# Altium schematic sheet Top.SchDoc
size A4
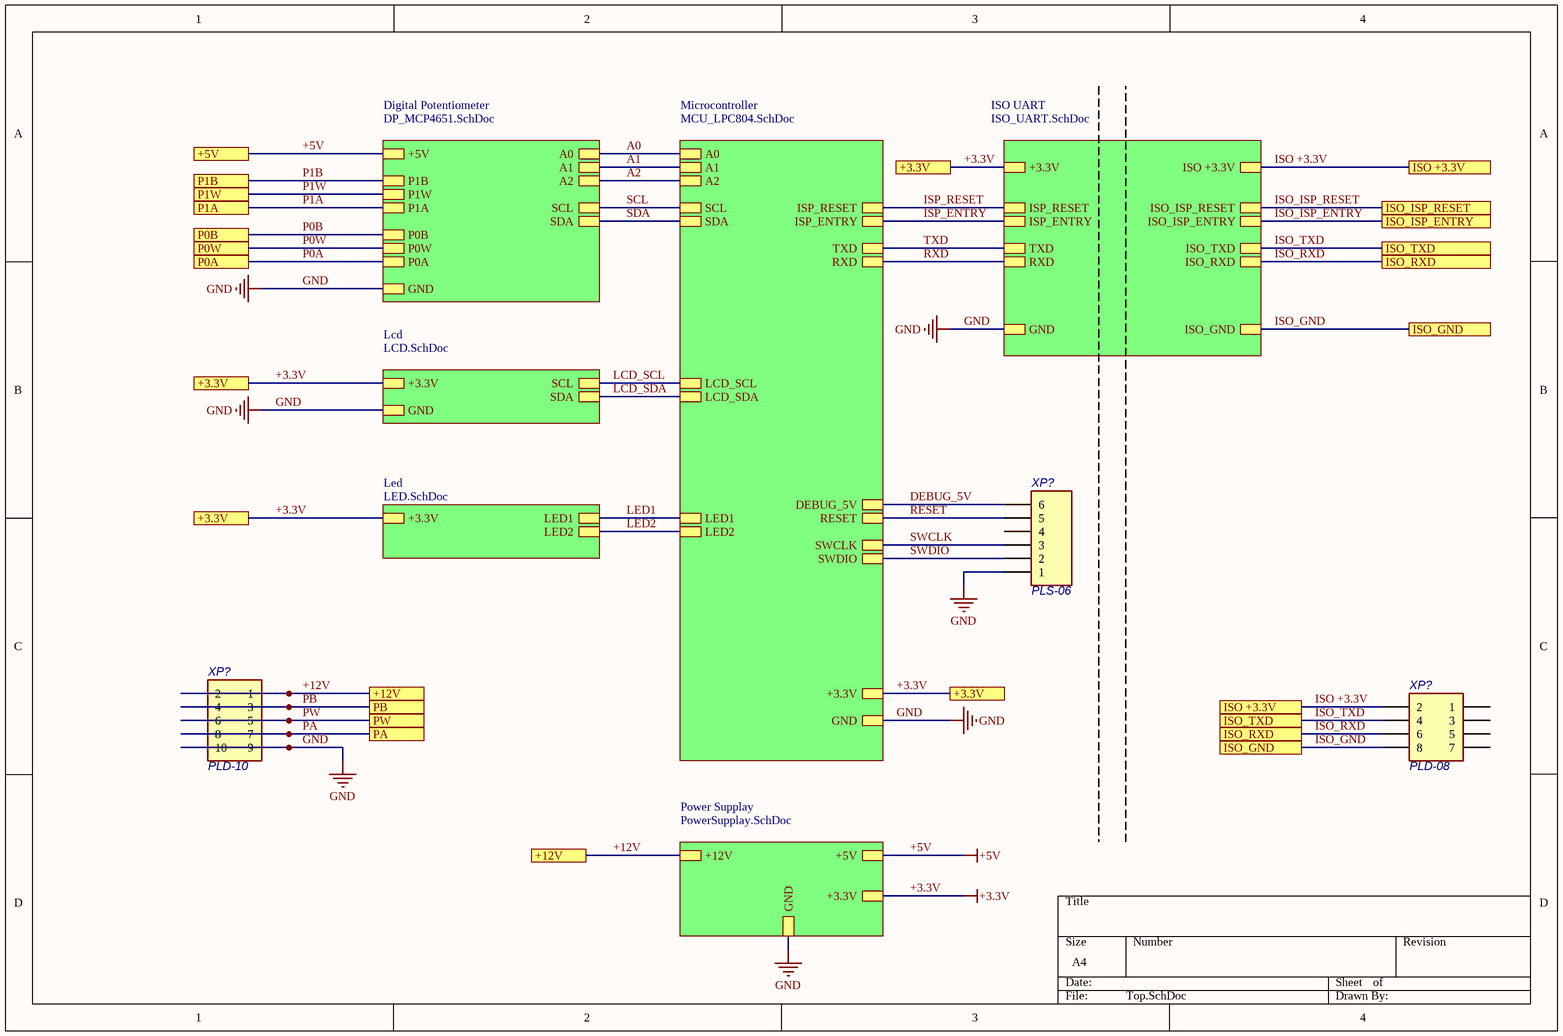
[diagram p0: Top.SchDoc]

## Parts
(Parts that share a designator on the sheet are numbered #1, #2 ... from top to bottom, then left to right.)
XP?#1  PLS-06  [PLS-06]
XP?#2  PLD-10  [PLD-10]
XP?#3  PLD-08  [PLD-08]

## Sub-sheets
Digital Potentiometer = DP_MCP4651.SchDoc: SCL, SDA, +5V, A0, A1, A2, P1B, P1W, P1A, P0B, P0A, P0W, GND
ISO UART = ISO_UART.SchDoc: ISP_RESET, ISP_ENTRY, ISO_ISP_RESET, ISO_ISP_ENTRY, +3.3V, ISO +3.3V, GND, ISO_GND, ISO_TXD, ISO_RXD, TXD, RXD
Lcd = LCD.SchDoc: GND, +3.3V, SCL, SDA
Led = LED.SchDoc: +3.3V, LED1, LED2
Microcontroller = MCU_LPC804.SchDoc: SCL, SDA, ISP_RESET, ISP_ENTRY, A0, A1, A2, LCD_SCL, LCD_SDA, DEBUG_5V, RESET, SWCLK, SWDIO, LED1, LED2, +3.3V, GND, TXD, RXD
Power Supplay = PowerSupplay.SchDoc: +3.3V, GND, +12V, +5V

## Ports
+3.3V, +5V, +12V, ISO +3.3V, ISO_GND, ISO_ISP_ENTRY, ISO_ISP_RESET, ISO_RXD, ISO_TXD, P0A, P0B, P0W, P1A, P1B, P1W, PA, PB, PW

## Nets
+3.3V: port +3.3V, sheet Microcontroller/+3.3V, sheet Power Supplay/+3.3V, sheet ISO UART/+3.3V, sheet Led/+3.3V, sheet Lcd/+3.3V
+5V: port +5V, sheet Digital Potentiometer/+5V, sheet Power Supplay/+5V
GND: XP?#1.1 XP?#2.9 XP?#2.10 ; sheet Digital Potentiometer/GND, sheet Microcontroller/GND, sheet Power Supplay/GND, sheet ISO UART/GND, sheet Lcd/GND
+12V: XP?#2.1 XP?#2.2 ; port +12V, sheet Power Supplay/+12V
A0: sheet Digital Potentiometer/A0, sheet Microcontroller/A0
A1: sheet Digital Potentiometer/A1, sheet Microcontroller/A1
A2: sheet Digital Potentiometer/A2, sheet Microcontroller/A2
DEBUG_5V: XP?#1.6 ; sheet Microcontroller/DEBUG_5V
ISO +3.3V: XP?#3.2 ; port ISO +3.3V, sheet ISO UART/ISO +3.3V
ISO_GND: XP?#3.8 ; port ISO_GND, sheet ISO UART/ISO_GND
ISO_ISP_ENTRY: port ISO_ISP_ENTRY, sheet ISO UART/ISO_ISP_ENTRY
ISO_ISP_RESET: port ISO_ISP_RESET, sheet ISO UART/ISO_ISP_RESET
ISO_RXD: XP?#3.6 ; port ISO_RXD, sheet ISO UART/ISO_RXD
ISO_TXD: XP?#3.4 ; port ISO_TXD, sheet ISO UART/ISO_TXD
ISP_ENTRY: sheet Microcontroller/ISP_ENTRY, sheet ISO UART/ISP_ENTRY
ISP_RESET: sheet Microcontroller/ISP_RESET, sheet ISO UART/ISP_RESET
LCD_SCL: sheet Microcontroller/LCD_SCL, sheet Lcd/SCL
LCD_SDA: sheet Microcontroller/LCD_SDA, sheet Lcd/SDA
LED1: sheet Microcontroller/LED1, sheet Led/LED1
LED2: sheet Microcontroller/LED2, sheet Led/LED2
P0A: port P0A, sheet Digital Potentiometer/P0A
P0B: port P0B, sheet Digital Potentiometer/P0B
P0W: port P0W, sheet Digital Potentiometer/P0W
P1A: port P1A, sheet Digital Potentiometer/P1A
P1B: port P1B, sheet Digital Potentiometer/P1B
P1W: port P1W, sheet Digital Potentiometer/P1W
PA: XP?#2.7 XP?#2.8 ; port PA
PB: XP?#2.3 XP?#2.4 ; port PB
PW: XP?#2.5 XP?#2.6 ; port PW
RESET: XP?#1.5 ; sheet Microcontroller/RESET
RXD: sheet Microcontroller/RXD, sheet ISO UART/RXD
SCL: sheet Digital Potentiometer/SCL, sheet Microcontroller/SCL
SDA: sheet Digital Potentiometer/SDA, sheet Microcontroller/SDA
SWCLK: XP?#1.3 ; sheet Microcontroller/SWCLK
SWDIO: XP?#1.2 ; sheet Microcontroller/SWDIO
TXD: sheet Microcontroller/TXD, sheet ISO UART/TXD

Not connected (* = marked no-connect by the designer): XP?#1 4; XP?#3 1 3 5 7

## Library data of the parts
XP?#1 = PLS-06: Однорядный прямой штыревой соединитель; Manufacturer: BrownBear; SpecificationName: Connector; Ведомость покупных: Y; Author: Gr.; Part Number: PLS-06; DateModification: 24.03.2011; ManufacturerPartNumber: PLS-06; Value: *; Tolerance: *; Power\Voltage: *; TKE: *; Корпус: *; TU/GOST: *; Примечание: *; Rem: *; ComponentLink1Description: Parametrs; ComponentLink2Description: Site; ComponentLink2URL: http://www.brownbear.ru/; Component Type: Standard; Component Kind: Standard
XP?#2 = PLD-10: Двухрядный прямой штыревой соединитель; Manufacturer: BrownBear; SpecificationName: Connector; Ведомость покупных: Y; Author: Gr.; Part Number: PLD-10; DateModification: 24.03.2011; ManufacturerPartNumber: PLD-10; Value: *; Tolerance: *; Power\Voltage: *; TKE: *; Корпус: *; TU/GOST: *; Примечание: *; Rem: *; ComponentLink1Description: Parametrs; ComponentLink2Description: Site; ComponentLink2URL: http://www.brownbear.ru/; Component Type: Standard; Component Kind: Standard
XP?#3 = PLD-08: Двухрядный прямой штыревой соединитель; Manufacturer: BrownBear; SpecificationName: Connector; Ведомость покупных: Y; Author: Gr.; Part Number: PLD-08; DateModification: 24.03.2011; ManufacturerPartNumber: PLD-08; Value: *; Tolerance: *; Power\Voltage: *; TKE: *; Корпус: *; TU/GOST: *; Примечание: *; Rem: *; ComponentLink1Description: Parametrs; ComponentLink2Description: Site; ComponentLink2URL: http://www.brownbear.ru/; Component Type: Standard; Component Kind: Standard